# EAGLE design M420X (EAGLE 6.6.0)
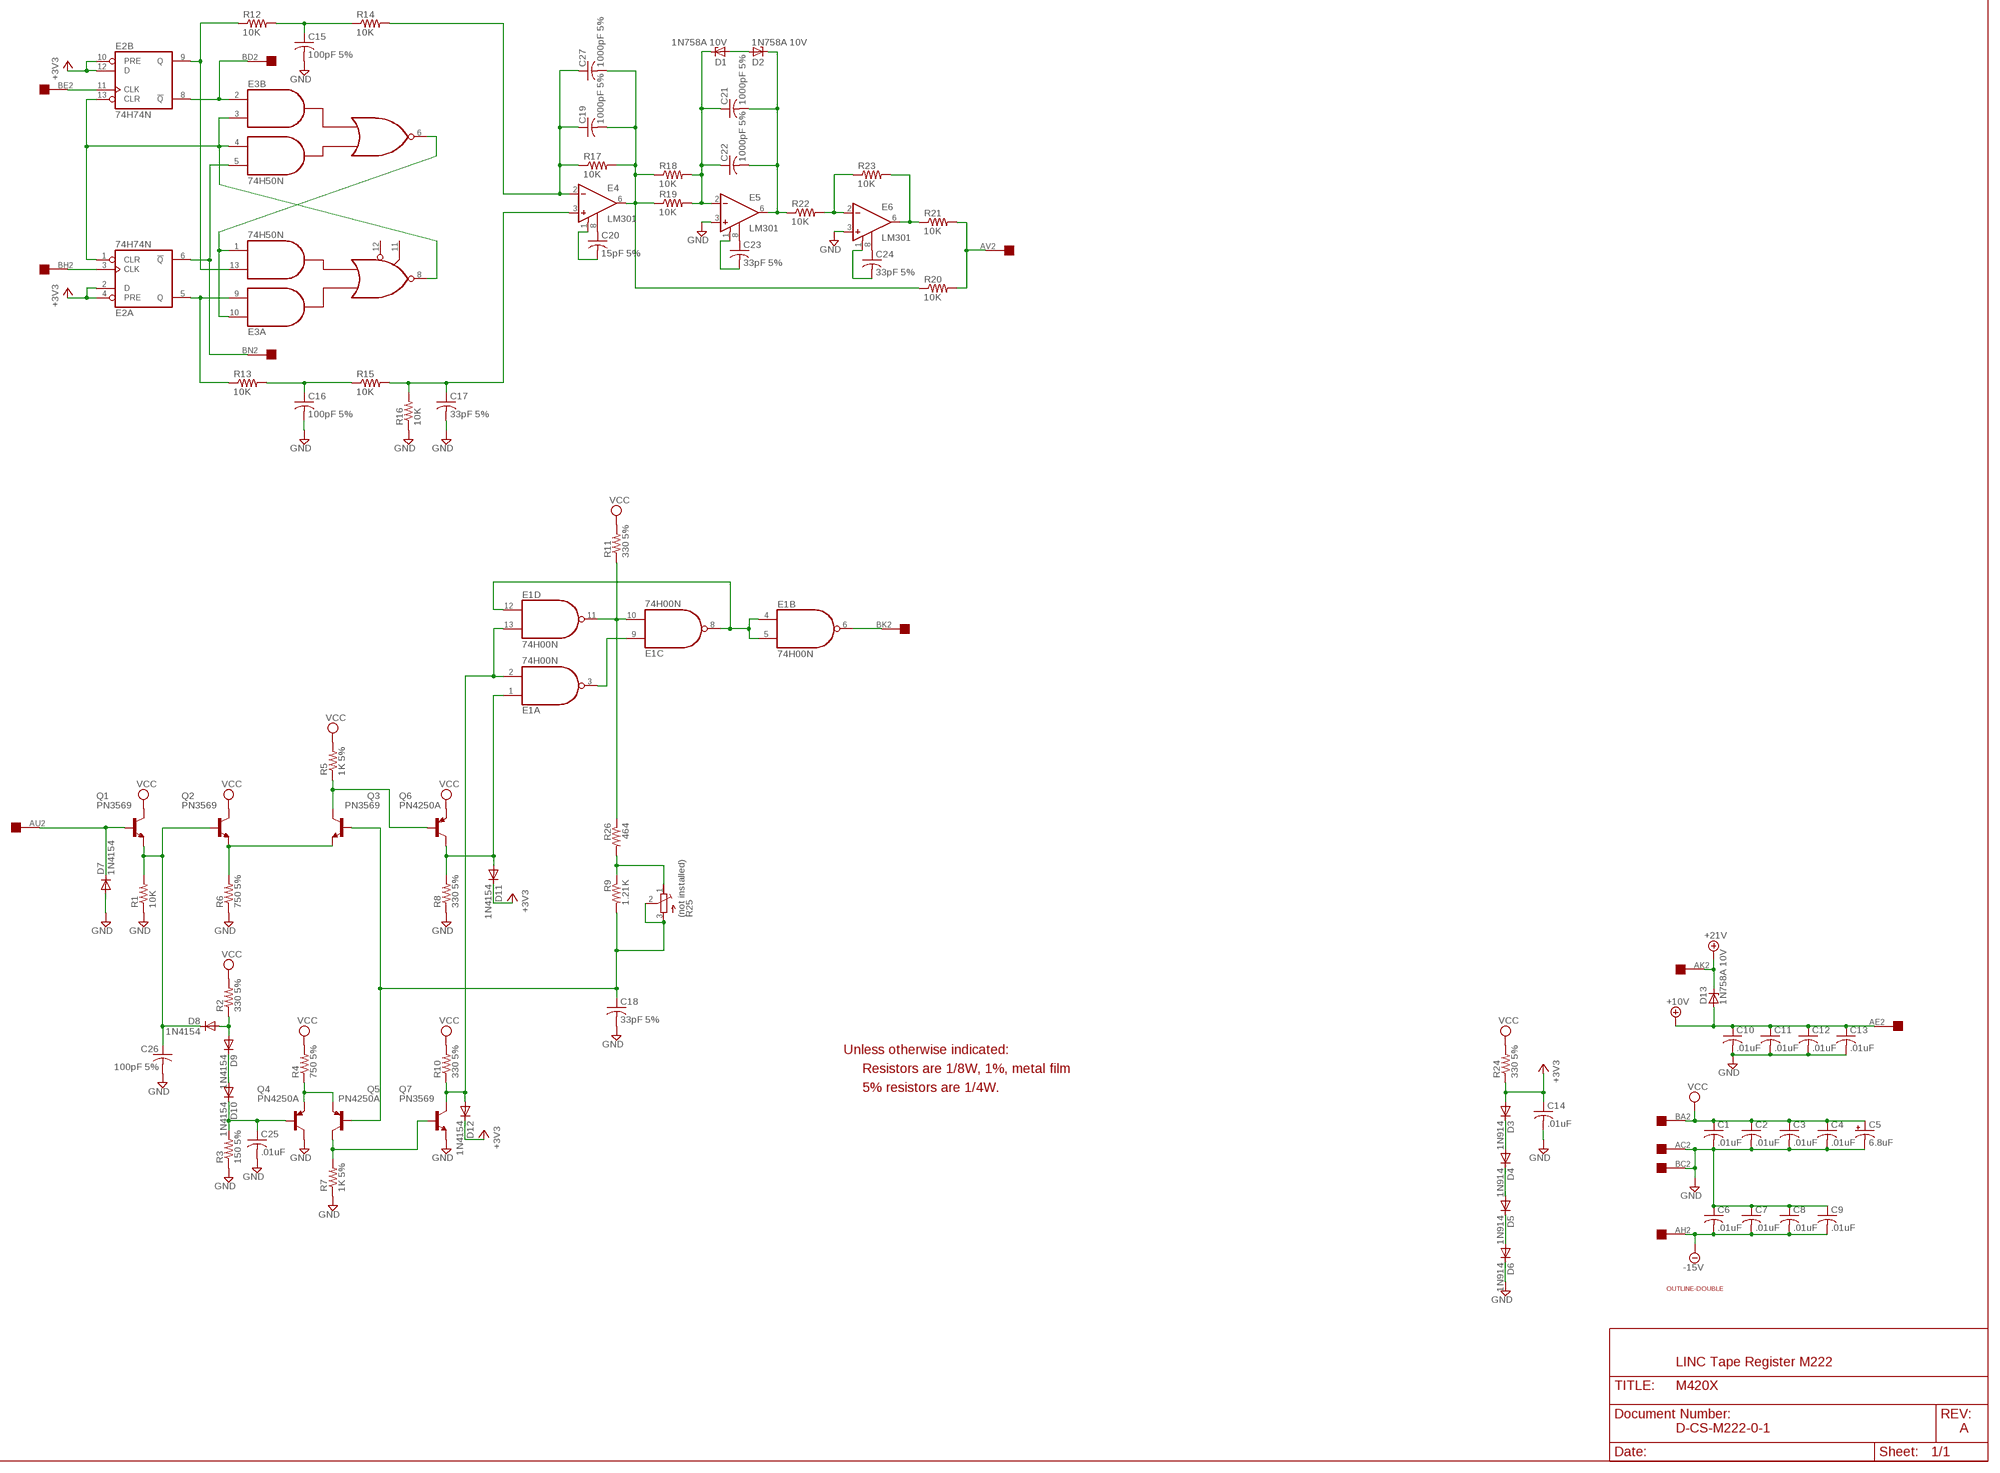
[diagram p0: schematic, sheet 1]

## Parts
C1  .01uF  C-US050-025X075  [C050-025X075]
C2  .01uF  C-US050-025X075  [C050-025X075]
C3  .01uF  C-US050-025X075  [C050-025X075]
C4  .01uF  C-US050-025X075  [C050-025X075]
C5  6.8uF  CPOL-USE20-8AXIAL  [E12-8]
C6  .01uF  C-US050-025X075  [C050-025X075]
C7  .01uF  C-US050-025X075  [C050-025X075]
C8  .01uF  C-US050-025X075  [C050-025X075]
C9  .01uF  C-US050-025X075  [C050-025X075]
C10  .01uF  C-US050-025X075  [C050-025X075]
C11  .01uF  C-US050-025X075  [C050-025X075]
C12  .01uF  C-US050-025X075  [C050-025X075]
C13  .01uF  C-US050-025X075  [C050-025X075]
C14  .01uF  C-US050-025X075  [C050-025X075]
C15  100pF 5%  C-US050-025X075  [C050-025X075]
C16  100pF 5%  C-US050-025X075  [C050-025X075]
C17  33pF 5%  C-US050-025X075  [C050-025X075]
C18  33pF 5%  C-US050-025X075  [C050-025X075]
C19  1000pF 5%  C-US050-025X075  [C050-025X075]
C20  15pF 5%  C-US050-025X075  [C050-025X075]
C21  1000pF 5%  C-US050-025X075  [C050-025X075]
C22  1000pF 5%  C-US050-025X075  [C050-025X075]
C23  33pF 5%  C-US050-025X075  [C050-025X075]
C24  33pF 5%  C-US050-025X075  [C050-025X075]
C25  .01uF  C-US050-025X075  [C050-025X075]
C26  100pF 5%  C-US050-025X075  [C050-025X075]
C27  1000pF 5%  C-US050-025X075  [C050-025X075]
D1  1N758A 10V  ZENER-DIODEDO35Z10  [DO35Z10]
D2  1N758A 10V  ZENER-DIODEDO35Z10  [DO35Z10]
D3  1N914  1N4148DO35-10  [DO35-10]
D4  1N914  1N4148DO35-10  [DO35-10]
D5  1N914  1N4148DO35-10  [DO35-10]
D6  1N914  1N4148DO35-10  [DO35-10]
D7  1N4154  1N4148DO35-10  [DO35-10]
D8  1N4154  1N4148DO35-10  [DO35-10]
D9  1N4154  1N4148DO35-10  [DO35-10]
D10  1N4154  1N4148DO35-10  [DO35-10]
D11  1N4154  1N4148DO35-10  [DO35-10]
D12  1N4154  1N4148DO35-10  [DO35-10]
D13  1N758A 10V  ZENER-DIODEDO35Z10  [DO35Z10]
E1  74H00N  7400N  [DIL14]
E2  74H74N  74S74N  [DIL14]
E3  74H50N  7450N  [DIL14]
E4  LM301  [TO99]
E5  LM301  [TO99]
E6  LM301  [TO99]
Q1  PN3569  2N3439  [TO5]
Q2  PN3569  2N3439  [TO5]
Q3  PN3569  2N3439  [TO5]
Q4  PN4250A  2N3635  [TO39]
Q5  PN4250A  2N3635  [TO39]
Q6  PN4250A  2N3635  [TO39]
Q7  PN3569  2N3439  [TO5]
R1  10K  R-US_0207/15  [0207/15]
R2  330 5%  R-US_0207/10  [0207/10]
R3  150 5%  R-US_0207/10  [0207/10]
R4  750 5%  R-US_0207/10  [0207/10]
R5  1K 5%  R-US_0207/10  [0207/10]
R6  750 5%  R-US_0207/10  [0207/10]
R7  1K 5%  R-US_0207/10  [0207/10]
R8  330 5%  R-US_0207/10  [0207/10]
R9  1.21K  R-US_0207/15  [0207/15]
R10  330 5%  R-US_0207/10  [0207/10]
R11  330 5%  R-US_0207/10  [0207/10]
R12  10K  R-US_0207/15  [0207/15]
R13  10K  R-US_0207/15  [0207/15]
R14  10K  R-US_0207/15  [0207/15]
R15  10K  R-US_0207/15  [0207/15]
R16  10K  R-US_0207/15  [0207/15]
R17  10K  R-US_0207/15  [0207/15]
R18  10K  R-US_0207/15  [0207/15]
R19  10K  R-US_0207/15  [0207/15]
R20  10K  R-US_0207/15  [0207/15]
R21  10K  R-US_0207/15  [0207/15]
R22  10K  R-US_0207/15  [0207/15]
R23  10K  R-US_0207/15  [0207/15]
R24  330 5%  R-US_0207/10  [0207/10]
R25  (not installed)  275P  [3006Y]
R26  464  R-US_0207/15  [0207/15]
U$1  DOUBLE  [EDGE-CON4]
U$2  OUTLINE-DOUBLE  [DOUBLE]

## Nets
+3V3 [Supply]: C14.1 D3.A D11.C D12.C E2.2(A:D) E2.4(A:PRE) E2.10(B:PRE) E2.12(B:D) R24.1
+10V [Supply]: C10.1 C11.1 C12.1 C13.1 D13.A U$1.AE2
+21V [Supply]: D13.C U$1.AK2
-15V [Supply]: C6.2 C7.2 C8.2 C9.2 U$1.AH2
GND [Supply]: C1.2 C2.2 C3.2 C4.2 C5.- C6.1 C7.1 C8.1 C9.1 C10.2 C11.2 C12.2 C13.2 C14.2 C15.2 C16.2 C17.2 C18.2 C25.2 C26.2 D6.C D7.A E5.3(+IN) E6.3(+IN) Q4.3(C) Q7.1(E) R1.1 R3.1 R6.1 R7.1 R8.1 R16.1 U$1.AC2 U$1.BC2
N$1: E2.1(A:CLR) E2.13(B:CLR) E3.3(B:I2) E3.4(B:I3) E3.8(A:O)
N$2: E3.1(A:I4) E3.6(B:O) E3.10(A:I1)
N$3: E2.8(B:!Q) E3.2(B:I1) U$1.BD2
N$4: E2.6(A:!Q) E3.5(B:I4) U$1.BN2
N$5: E2.3(A:CLK) U$1.BH2
N$6: C17.1 E4.3(+IN) R15.2 R16.2
N$7: C15.1 R12.2 R14.1
N$8: E2.9(B:Q) E3.13(A:I3) R12.1
N$9: E2.5(A:Q) E3.9(A:I2) R13.1
N$10: E2.11(B:CLK) U$1.BE2
N$11: D3.C D4.A
N$12: C16.1 R13.2 R15.1
N$13: C20.1 E4.8(CMP)
N$14: D5.C D6.A
N$15: C19.1 C27.1 E4.2(-IN) R14.2 R17.1
N$16: C20.2 E4.1(ON/CMP)
N$17: C19.2 C27.2 E4.6(OUT) R17.2 R18.1 R19.1 R20.1
N$18: C21.1 C22.1 D1.C E5.2(-IN) R18.2 R19.2
N$19: D4.C D5.A
N$20: C21.2 C22.2 D2.C E5.6(OUT) R22.1
N$21: D1.A D2.A
N$22: C23.1 E5.8(CMP)
N$23: C23.2 E5.1(ON/CMP)
N$24: E6.2(-IN) R22.2 R23.1
N$25: C24.1 E6.8(CMP)
N$26: C24.2 E6.1(ON/CMP)
N$27: E6.6(OUT) R21.1 R23.2
N$28: R20.2 R21.2 U$1.AV2
N$29: E1.6(B:O) U$1.BK2
N$30: E1.4(B:I0) E1.5(B:I1) E1.8(C:O) E1.12(D:I0)
N$31: E1.10(C:I1) E1.11(D:O) R11.1 R26.1
N$32: D12.A E1.2(A:I1) E1.13(D:I1) Q7.3(C) R10.1
N$33: D11.A E1.1(A:I0) Q6.3(C) R8.2
N$34: E1.3(A:O) E1.9(C:I0)
N$35: D7.C Q1.2(B) U$1.AU2
N$36: C26.1 D8.C Q1.1(E) Q2.2(B) R1.2
N$37: Q2.1(E) Q3.1(E) R6.2
N$38: Q3.3(C) Q6.2(B) R5.1
N$39: C18.1 Q3.2(B) Q5.2(B) R9.2 R25.2(S) R25.3(E)
N$40: Q4.1(E) Q5.1(E) R4.1
N$41: Q5.3(C) Q7.2(B) R7.2
N$42: R9.1 R25.1(A) R26.2
N$44: D8.A D9.A R2.1
N$45: D9.C D10.A
N$46: C25.1 D10.C Q4.2(B) R3.2
VCC [Supply]: C1.1 C2.1 C3.1 C4.1 C5.+ Q1.3(C) Q2.3(C) Q6.1(E) R2.2 R4.2 R5.2 R10.2 R11.2 R24.2 U$1.BA2
Unconnected: E3.11(A:I6) E3.12(A:I5) U$1.AA1 U$1.AA2 U$1.AB1 U$1.AB2 U$1.AC1 U$1.AD1 U$1.AD2 U$1.AE1 U$1.AF1 U$1.AF2 U$1.AH1 U$1.AJ1 U$1.AJ2 U$1.AK1 U$1.AL1 U$1.AL2 U$1.AM1 U$1.AM2 U$1.AN1 U$1.AN2 U$1.AP1 U$1.AP2 U$1.AR1 U$1.AR2 U$1.AS1 U$1.AS2 U$1.AT1 U$1.AT2 U$1.AU1 U$1.AV1 U$1.BA1 U$1.BB1 U$1.BB2 U$1.BC1 U$1.BD1 U$1.BE1 U$1.BF1 U$1.BF2 U$1.BH1 U$1.BJ1 U$1.BJ2 U$1.BK1 U$1.BL1 U$1.BL2 U$1.BM1 U$1.BM2 U$1.BN1 U$1.BP1 U$1.BP2 U$1.BR1 U$1.BR2 U$1.BS1 U$1.BS2 U$1.BT1 U$1.BT2 U$1.BU1 U$1.BU2 U$1.BV1 U$1.BV2

## Notes on the sheet
- Unless otherwise indicated:
- Resistors are 1/8W, 1%, metal film
- 5% resistors are 1/4W.
- LINC Tape Register M222
- D-CS-M222-0-1 | A

## Power pins joined to a net without a drawn wire
+10V: E4.7(+10V) E5.7(+10V) E6.7(+10V)
-15V: E4.4(-15V) E5.4(-15V) E6.4(-15V)
GND: E1.7(P:GND) E2.7(P:GND) E3.7(P:GND)
VCC: E1.14(P:VCC) E2.14(P:VCC) E3.14(P:VCC)

## Library data of the parts
C1-C4 C6-C27 = rcl:C-US: CAPACITOR, American symbol
C5 = dec-con:CPOL-USE20-8AXIAL: A 0.8 inch electrolytic.
D1 D2 D13 = diode:ZENER-DIODE: Z-Diode
D3-D12 = diode:1N4148: DIODE high speed (Philips)
E1 = 74xx-us:74*00: Quad 2-input NAND gate
E2 = 74xx-us:74*74: Dual D type positive edge triggered FLIP FLOP, preset and clear
E3 = dec-con:74*50: 4-2-3-2 input AND OR INVERTER gates
E4-E6 = dec-con:LM301: LM301 Operational Amplifier
Q1-Q3 Q7 = transistor-npn:2N3439: NPN Transistor
Q4-Q6 = transistor-pnp:2N3635*: PNP Transistror
R1-R24 R26 = rcl:R-US_: RESISTOR, American symbol
R25 = dec-con:275P: Trimpot with 275P (3006Y) footprint.
U$1 = dec-con:DOUBLE: Double-Height DEC board
U$2 = dec-con:OUTLINE-*: Board outlines for DEC boards.

## Net classes
1 Supply: width 0.813 mm

## Board
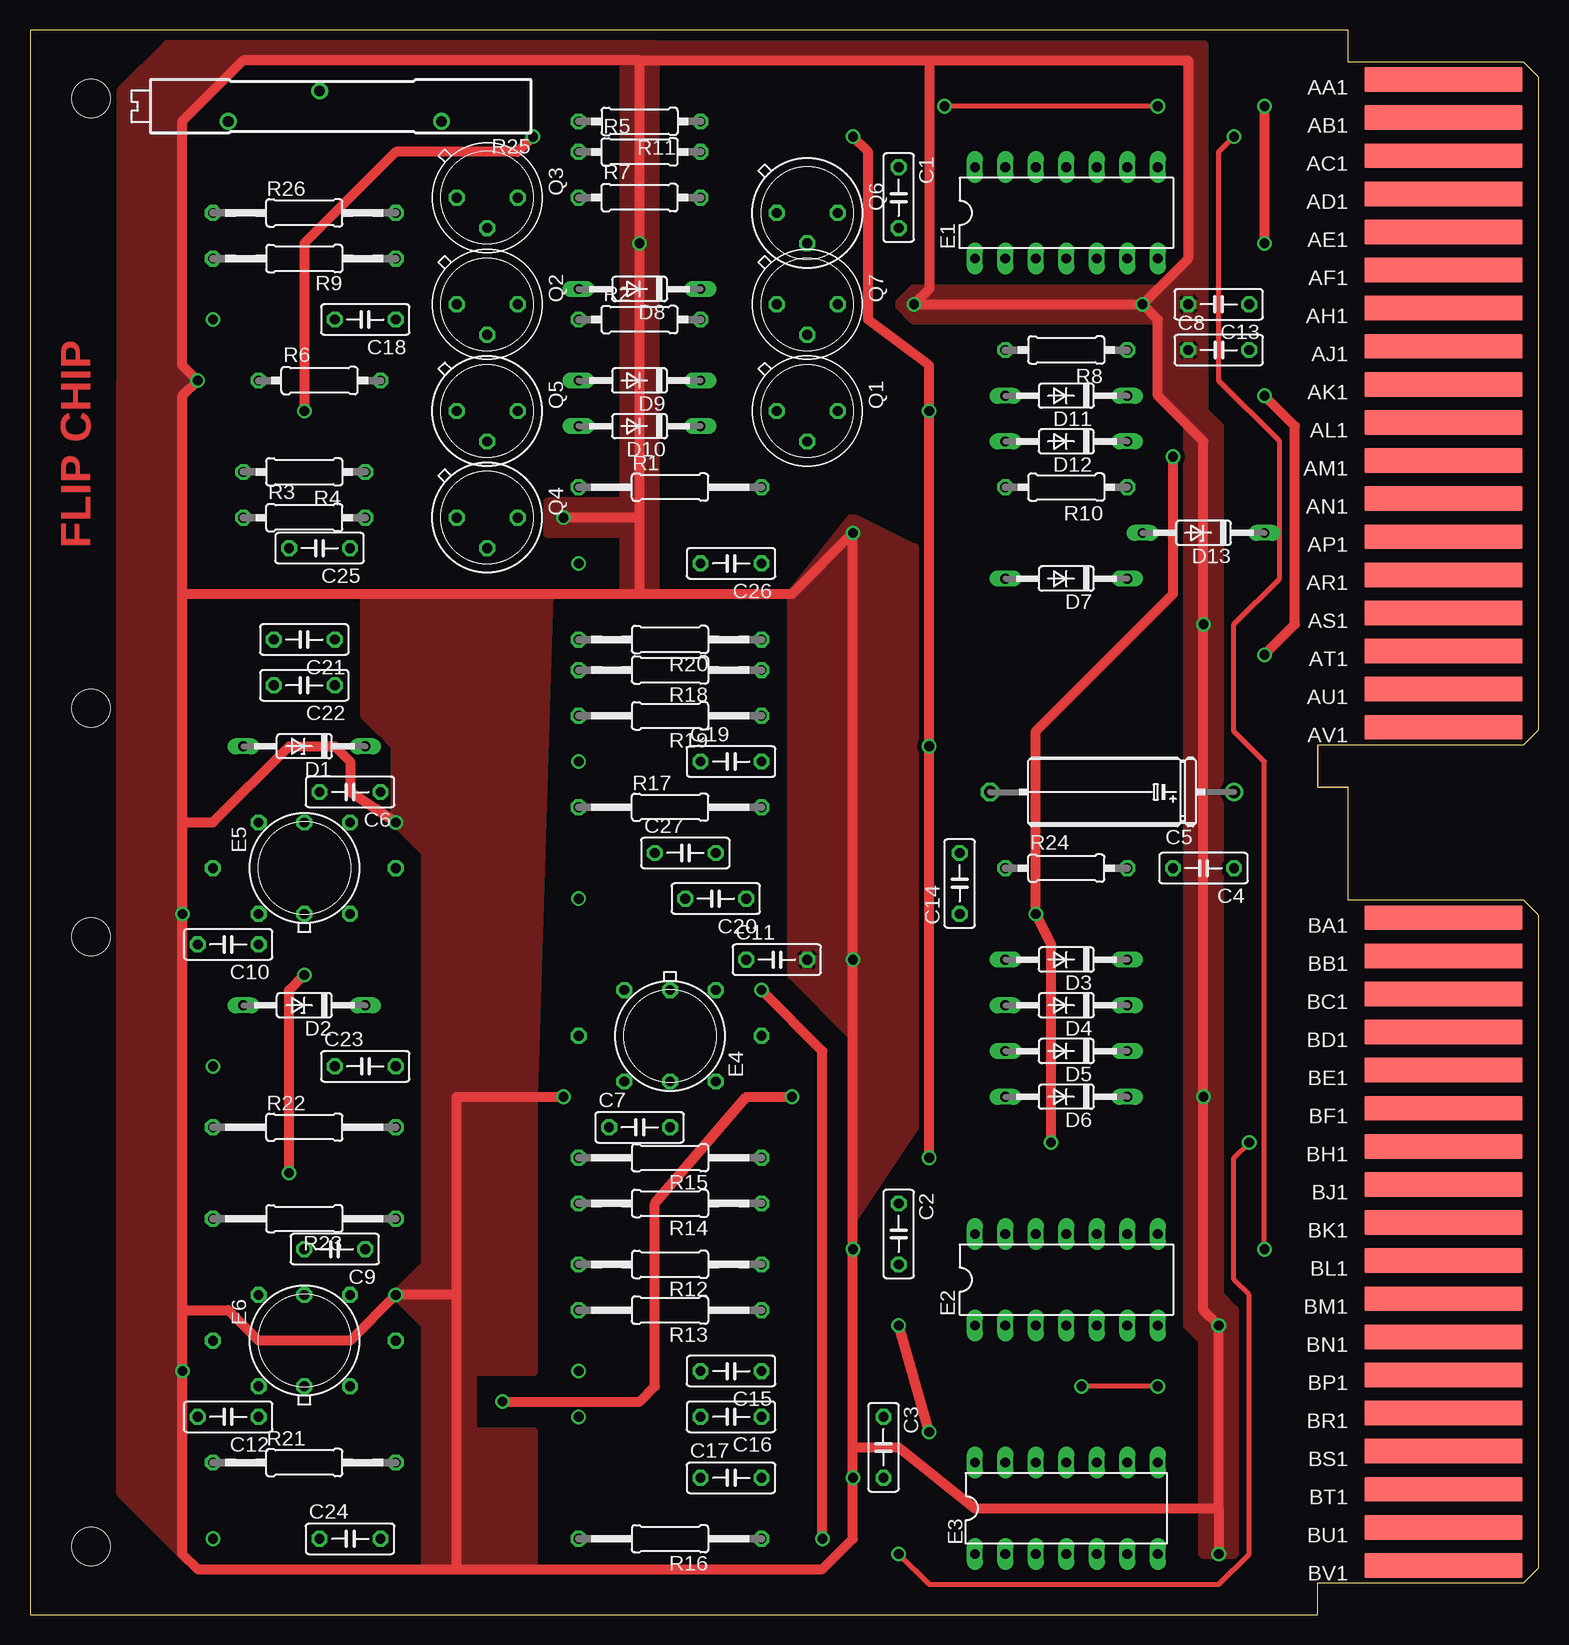
[diagram p1: board, top side]
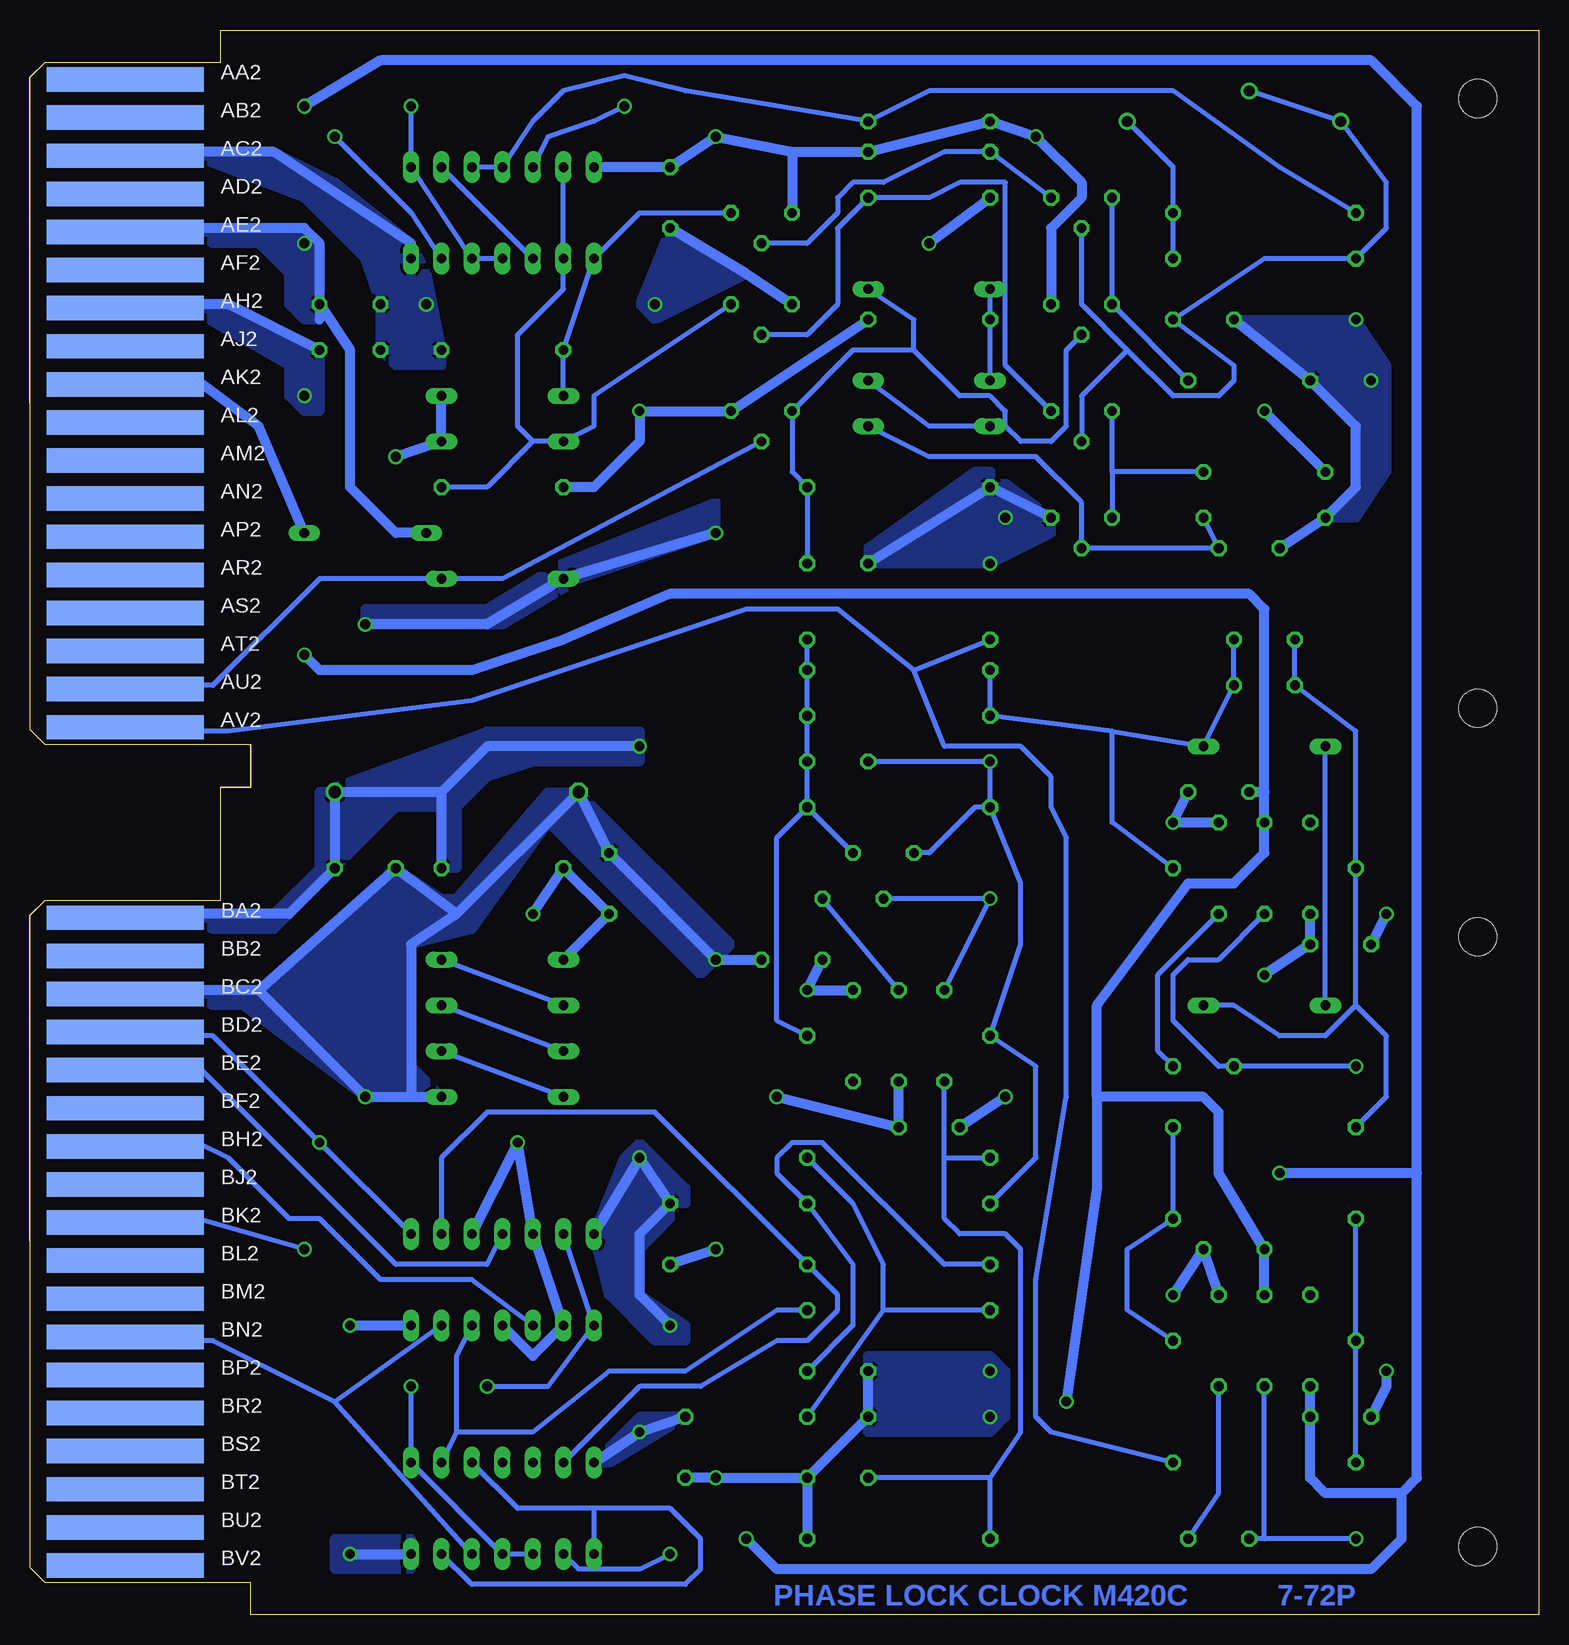
[diagram p2: board, bottom side, seen from below]

Size 125.73 x 132.08 mm. Coordinates in mm from the lower left corner, seen from the top.
Copper layers (1+16): Top 0.035mm / dielectric 1.5mm / Bottom 0.035mm
Design rules "16mils": minimum track width 16mil, minimum drill 32mil, track to track 15mil, track to pad 10mil, pad to pad 10mil, via to via 10mil, smd to smd 10mil, copper to edge 13mil, drill to drill 10mil, minimum pad ring 10mil, minimum via ring 8mil, stop-mask expansion 0mil, vias tented up to drill 0mil, thermal gap 10mil

### Footprints (pad centres in the part's own frame; a part is rotated, then mirrored left to right if it is on the bottom)
C050-025X075 = drill 0.813 octagon: 1 -2.54,0; 2 2.54,0
E12-8 = drill 1.016: + -10.16,0 | drill 1.016 octagon: - 10.16,0
DO35Z10 = drill 0.813 long: A 5.08,0; C -5.08,0
DO35-10 = drill 0.813 long: A 5.08,0; C -5.08,0
DIL14 = drill 0.813 long: 1 -7.62,-3.81; 2 -5.08,-3.81; 3 -2.54,-3.81; 4 0,-3.81; 5 2.54,-3.81; 6 5.08,-3.81; 7 7.62,-3.81; 8 7.62,3.81; 9 5.08,3.81; 10 2.54,3.81; 11 0,3.81; 12 -2.54,3.81; 13 -5.08,3.81; 14 -7.62,3.81
TO99 = drill 0.813 octagon: 1 -3.81,-3.81; 2 0,-7.62; 3 3.81,-3.81; 4 3.81,0; 5 3.81,3.81; 6 0,7.62; 7 -3.81,3.81; 8 -3.81,0
TO5 = drill 0.813 octagon: 1 0,-2.54; 2 2.54,0; 3 0,2.54
TO39 = drill 0.813 octagon: 1 0,-2.54; 2 2.54,0; 3 0,2.54
0207/15 = drill 0.813 octagon: 1 -7.62,0; 2 7.62,0
0207/10 = drill 0.813 octagon: 1 -5.08,0; 2 5.08,0
3006Y = drill 0.9: 1 -8.89,1.27; 2 1.27,-1.27; 3 8.89,1.27
EDGE-CON4 = smd 13.106 x 2.032: AA1 7.938,4.128; AB1 7.938,7.303; AC1 7.938,10.477; AD1 7.938,13.652; AE1 7.938,16.828; AF1 7.938,20.003; AH1 7.938,23.177; AJ1 7.938,26.352; AK1 7.938,29.527; AL1 7.938,32.703; AM1 7.938,35.877; AN1 7.938,39.053; AP1 7.938,42.227; AR1 7.938,45.403; AS1 7.938,48.578; AT1 7.938,51.752; AU1 7.938,54.928; AV1 7.938,58.102; BA1 7.938,73.978; BB1 7.938,77.153; BC1 7.938,80.328; BD1 7.938,83.502; BE1 7.938,86.677; BF1 7.938,89.853; BH1 7.938,93.028; BJ1 7.938,96.203; BK1 7.938,99.377; BL1 7.938,102.552; BM1 7.938,105.728; BN1 7.938,108.903; BP1 7.938,112.078; BR1 7.938,115.252; BS1 7.938,118.427; BT1 7.938,121.603; BU1 7.938,124.778; BV1 7.938,127.953 | smd 13.106 x 2.032 bottom: AA2 7.938,4.128; AB2 7.938,7.303; AC2 7.938,10.477; AD2 7.938,13.652; AE2 7.938,16.828; AF2 7.938,20.003; AH2 7.938,23.177; AJ2 7.938,26.352; AK2 7.938,29.527; AL2 7.938,32.703; AM2 7.938,35.877; AN2 7.938,39.053; AP2 7.938,42.227; AR2 7.938,45.403; AS2 7.938,48.578; AT2 7.938,51.752; AU2 7.938,54.928; AV2 7.938,58.102; BA2 7.938,73.978; BB2 7.938,77.153; BC2 7.938,80.328; BD2 7.938,83.502; BE2 7.938,86.677; BF2 7.938,89.853; BH2 7.938,93.028; BJ2 7.938,96.203; BK2 7.938,99.377; BL2 7.938,102.552; BM2 7.938,105.728; BN2 7.938,108.903; BP2 7.938,112.078; BR2 7.938,115.252; BS2 7.938,118.427; BT2 7.938,121.603; BU2 7.938,124.778; BV2 7.938,127.953
DOUBLE = hole 3.175: 120.65,56.515; 120.65,5.715; 120.65,75.565; 120.65,126.365

### Placement (x,y rotation side)
C1  72.39,118.11 270 top
C2  72.39,31.75 270 top
C3  71.12,13.97 270 top
C4  97.79,62.23 180 top
C5  90.17,68.58 180 top
C6  26.67,68.58 180 top
C7  50.8,40.64 0 top
C8  99.06,105.41 0 top
C9  25.4,30.48 180 top
C10  16.51,55.88 180 top
C11  62.23,54.61 0 top
C12  16.51,16.51 180 top
C13  99.06,109.22 180 top
C14  77.47,60.96 90 top
C15  58.42,20.32 180 top
C16  58.42,16.51 180 top
C17  58.42,11.43 0 top
C18  27.94,107.95 180 top
C19  58.42,71.12 0 top
C20  57.15,59.69 180 top
C21  22.86,81.28 180 top
C22  22.86,77.47 180 top
C23  27.94,45.72 0 top
C24  26.67,6.35 0 top
C25  24.13,88.9 180 top
C26  58.42,87.63 180 top
C27  54.61,63.5 0 top
D1  22.86,72.39 180 top
D2  22.86,50.8 180 top
D3  86.36,54.61 180 top
D4  86.36,50.8 180 top
D5  86.36,46.99 180 top
D6  86.36,43.18 180 top
D7  86.36,86.36 180 top
D8  50.8,110.49 180 top
D9  50.8,102.87 180 top
D10  50.8,99.06 180 top
D11  86.36,101.6 180 top
D12  86.36,97.79 180 top
D13  97.79,90.17 180 top
E1  86.36,116.84 0 top
E2  86.36,27.94 0 top
E3  86.36,8.89 0 top
E4  53.34,48.26 270 top
E5  22.86,62.23 90 top
E6  22.86,22.86 90 top
Q1  64.77,100.33 270 top
Q2  38.1,109.22 270 top
Q3  38.1,118.11 270 top
Q4  38.1,91.44 270 top
Q5  38.1,100.33 270 top
Q6  64.77,116.84 270 top
Q7  64.77,109.22 270 top
R1  53.34,93.98 0 top
R2  50.8,107.95 0 top
R3  22.86,91.44 0 top
R4  22.86,95.25 180 top
R5  50.8,121.92 0 top
R6  24.13,102.87 0 top
R7  50.8,118.11 0 top
R8  86.36,105.41 180 top
R9  22.86,113.03 180 top
R10  86.36,93.98 180 top
R11  50.8,124.46 180 top
R12  53.34,29.21 180 top
R13  53.34,25.4 180 top
R14  53.34,34.29 180 top
R15  53.34,38.1 180 top
R16  53.34,6.35 180 top
R17  53.34,67.31 0 top
R18  53.34,78.74 180 top
R19  53.34,74.93 180 top
R20  53.34,81.28 180 top
R21  22.86,12.7 0 top
R22  22.86,40.64 0 top
R23  22.86,33.02 180 top
R24  86.36,62.23 0 top
R25  25.4,125.73 180 top
R26  22.86,116.84 0 top
U$1  125.73,132.08 180 top
U$2  125.73,132.08 180 top
U$4  [FLIPCHIP]  0,69.85 0 top

### Tracks (layer width: path | path; a pad name or v marks a point on that pad's centre or on a via)
+3V3  (via drill 0.81)
  Top 0.813: v85.09,39.37 85.09,55.88 v83.82,58.42 83.82,73.66 95.25,85.09 v95.25,96.52
  Bottom 0.813: D11.C D12.C v95.25,96.52 | D3.A C14.1 R24.1 v83.82,58.42 | E2.4 83.82,21.59 E2.2 E2.12 v85.09,39.37 E2.10
+10V  (via drill 0.81)
  Top 0.813: v102.87,125.73 v102.87,114.3 | v60.96,52.07 66.04,46.99 v66.04,6.35 | v21.59,36.83 21.59,52.07 v22.86,53.34
  Bottom 0.813: U$1.AE2 116.84,115.57 102.87,115.57 101.6,114.3 C13.1 | C13.1 101.6,107.95 | C13.1 99.06,105.41 99.06,93.98 95.25,90.17 D13.A | v102.87,125.73 96.52,129.54 13.97,129.54 10.16,125.73 10.16,36.83 | 10.16,36.83 10.16,11.43 11.43,10.16 | 11.43,10.16 17.78,10.16 19.05,11.43 C12.1 E6.7 | 11.43,10.16 11.43,6.35 13.97,3.81 63.5,3.81 v66.04,6.35 | 10.16,36.83 v21.59,36.83 | E4.7 v60.96,52.07 C11.1 | v22.86,53.34 C10.1 E5.7
  pour Bottom: 113.03,115.57 102.87,115.57 101.6,114.3 101.6,107.95 102.87,107.95 104.14,109.22 104.14,111.76 106.68,114.3 110.49,114.3
+21V
  Bottom 0.813: U$1.AK2 116.84,102.87 111.76,102.87 106.68,99.06 D13.C
-15V  (via drill 0.81)
  Top 0.813: v39.37,17.78 50.8,17.78 52.07,19.05 52.07,34.29 59.69,43.18 v63.5,43.18 | v102.87,101.6 105.41,99.06 105.41,82.55 v102.87,80.01
  Bottom 0.813: U$1.AH2 116.84,109.22 109.22,109.22 C8.2 | E6.4 C9.2 26.67,36.83 26.67,41.91 27.94,43.18 36.83,43.18 | 36.83,43.18 36.83,35.56 v39.37,17.78 | 22.86,68.58 E5.4 22.86,63.5 25.4,60.96 29.21,60.96 36.83,50.8 36.83,43.18 | 22.86,68.58 C6.2 | 22.86,68.58 22.86,83.82 24.13,85.09 72.39,85.09 81.28,81.28 88.9,78.74 101.6,78.74 v102.87,80.01 | E4.4 C7.2 v63.5,43.18
  pour Bottom: 113.03,109.22 109.22,109.22 101.6,105.41 101.6,100.33 102.87,100.33 104.14,101.6 104.14,104.14
GND  (via drill 0.81)
  Top 0.813: 12.7,25.4 v12.7,20.32 12.7,5.08 13.97,3.81 35.56,3.81 | 12.7,25.4 16.51,25.4 19.05,22.86 26.67,22.86 v30.48,26.67 35.56,26.67 | v92.71,109.22 v73.66,109.22 74.93,110.49 74.93,129.54 | v30.48,66.04 26.67,68.58 26.67,71.12 25.4,72.39 21.59,72.39 15.24,66.04 12.7,66.04 | 12.7,66.04 12.7,85.09 | 12.7,85.09 12.7,101.6 v13.97,102.87 12.7,104.14 12.7,124.46 17.78,129.54 50.8,129.54 | 12.7,66.04 v12.7,58.42 12.7,25.4 | 99.06,8.89 v99.06,24.13 97.79,25.4 v97.79,43.18 v97.79,82.55 97.79,97.79 93.98,101.6 93.98,107.95 v92.71,109.22 | 50.8,85.09 63.5,85.09 v68.58,90.17 v68.58,54.61 v68.58,30.48 68.58,13.97 | 50.8,85.09 50.8,91.44 | 50.8,91.44 v44.45,91.44 | 12.7,85.09 50.8,85.09 | 50.8,91.44 v50.8,114.3 50.8,129.54 | 35.56,3.81 35.56,26.67 | 35.56,3.81 66.04,3.81 68.58,6.35 v68.58,11.43 68.58,13.97 | v44.45,43.18 35.56,43.18 35.56,26.67 | 50.8,129.54 74.93,129.54 | 74.93,129.54 96.52,129.54 96.52,113.03 v92.71,109.22 | 68.58,13.97 72.39,13.97 78.74,8.89 99.06,8.89 | 99.06,8.89 v99.06,5.08
  Bottom 0.813: U$1.AC2 116.84,121.92 105.41,121.92 93.98,114.3 E1.7 | Q7.1 66.04,111.76 C1.2 | C17.2 R16.1 | C17.2 C16.2 C15.2 | C17.2 v68.58,11.43 C3.2 | E6.3 C9.1 v30.48,26.67 | C12.2 12.7,19.05 v12.7,20.32 | v12.7,58.42 C10.2 | E5.3 v30.48,66.04 C6.1 | C25.2 R3.1 15.24,93.98 15.24,99.06 R6.1 C18.2 | Q4.3 R1.1 C26.2 | v50.8,114.3 R7.1 | v68.58,90.17 D7.A 87.63,82.55 v97.79,82.55 | C11.2 v68.58,54.61 C14.2 C5.- 90.17,58.42 | 90.17,58.42 C4.2 106.68,52.07 | U$1.BC2 116.84,52.07 106.68,52.07 | 93.98,43.18 v97.79,43.18 106.68,52.07 | 93.98,43.18 D6.C | 90.17,58.42 93.98,55.88 93.98,43.18 | v44.45,43.18 C7.1 | v99.06,5.08 E3.7 | v99.06,24.13 E2.7 | v68.58,30.48 C2.2
  other vias: 15.24,107.95 45.72,20.32 45.72,16.51 45.72,87.63
  pour Bottom: 113.03,121.92 105.41,121.92 100.33,119.38 93.98,114.3 92.71,111.76 91.44,105.41 91.44,104.14 95.25,104.14 96.52,105.41 96.52,109.22 97.79,113.03 102.87,118.11
  pour Bottom: 72.39,115.57 74.93,109.22 73.66,107.95 66.04,111.76
  pour Bottom: 25.4,107.95 15.24,107.95 12.7,104.14 12.7,95.25 15.24,91.44 17.78,91.44 15.24,93.98 15.24,99.06 19.05,102.87
  pour Bottom: 40.64,91.44 45.72,95.25 46.99,95.25 55.88,88.9 55.88,87.63 45.72,87.63 40.64,90.17
  pour Bottom: 55.88,21.59 45.72,21.59 44.45,20.32 44.45,16.51 45.72,15.24 55.88,15.24
  pour Bottom: 93.98,5.08 93.98,3.81 100.33,3.81 100.33,6.35 93.98,6.35
  pour Bottom: 68.58,54.61 69.85,53.34 78.74,62.23 82.55,66.04 88.9,57.15 93.98,55.88 93.98,45.72 91.44,43.18 97.79,43.18 107.95,50.8 110.49,50.8 113.03,52.07 106.68,52.07 95.25,62.23 91.44,59.69 90.17,59.69 82.55,68.58 80.01,68.58 67.31,55.88
  pour Bottom: 68.58,90.17 68.58,92.71 81.28,87.63 87.63,83.82 97.79,83.82 97.79,82.55 86.36,82.55 80.01,86.36
  pour Top: 12.7,20.32 7.62,20.32 7.62,102.87 13.97,102.87 12.7,101.6
  pour Top: 12.7,5.08 7.62,10.16 7.62,20.32 12.7,20.32
  pour Top: 13.97,102.87 12.7,104.14 12.7,124.46 17.78,129.54 49.53,129.54 49.53,85.09 52.07,85.09 52.07,130.81 11.43,130.81 7.62,127 7.62,102.87
  pour Top: 33.02,3.81 33.02,24.13 30.48,26.67 33.02,29.21 33.02,63.5 30.48,66.04 30.48,72.39 27.94,74.93 27.94,85.09 43.18,85.09 41.91,43.18 41.91,20.32 36.83,20.32 36.83,15.24 41.91,15.24 41.91,3.81
  pour Top: 49.53,92.71 43.18,92.71 43.18,90.17 49.53,90.17
  pour Top: 63.5,85.09 68.58,91.44 73.66,88.9 73.66,40.64 68.58,33.02 68.58,48.26 63.5,53.34
  pour Top: 100.33,5.08 97.79,5.08 97.79,22.86 96.52,24.13 96.52,82.55 96.52,99.06 93.98,101.6 93.98,107.95 73.66,107.95 72.39,109.22 73.66,110.49 93.98,110.49 96.52,113.03 96.52,129.54 97.79,129.54 97.79,100.33 99.06,99.06 99.06,80.01 99.06,43.18 99.06,26.67 100.33,25.4
  pour Top: 52.07,130.81 97.79,130.81 97.79,129.54 52.07,129.54
N$1  (via drill 0.81)
  Top 0.406: v93.98,19.05 v87.63,19.05
  Bottom 0.406: E2.13 E2.1 82.55,19.05 v87.63,19.05 | v93.98,19.05 E3.8 E3.4 E3.3
N$2
  Bottom 0.406: E3.6 88.9,2.54 71.12,2.54 69.85,3.81 69.85,6.35 72.39,8.89 78.74,8.89 | 78.74,8.89 E3.1 | E3.10 85.09,8.89 78.74,8.89
N$3  (via drill 0.81)
  Top 0.406: v101.6,39.37 100.33,38.1 100.33,27.94 101.6,26.67 101.6,5.08 99.06,2.54 74.93,2.54 v72.39,5.08
  Bottom 0.406: U$1.BD2 116.84,48.26 110.49,48.26 v101.6,39.37 E2.8 | E3.2 80.01,3.81 74.93,3.81 v72.39,5.08
N$4
  Bottom 0.406: U$1.BN2 116.84,22.86 110.49,22.86 100.33,17.78 | 100.33,17.78 E2.6 | E3.5 100.33,17.78
N$5
  Bottom 0.406: U$1.BH2 116.84,39.37 111.76,39.37 109.22,38.1 104.14,33.02 101.6,33.02 96.52,27.94 88.9,27.94 E2.3
N$6
  Bottom 0.406: 45.72,11.43 C17.1 | R16.2 45.72,11.43 | 49.53,38.1 R15.2 | 49.53,38.1 E4.3 | 45.72,11.43 43.18,15.24 43.18,30.48 44.45,31.75 48.26,31.75 49.53,33.02 49.53,38.1
N$7
  Bottom 0.406: C15.1 57.15,24.13 57.15,29.21 R14.1 63.5,36.83 63.5,38.1 62.23,39.37 59.69,39.37 49.53,29.21 R12.2
N$8
  Bottom 0.406: E3.13 74.93,19.05 69.85,19.05 63.5,22.86 60.96,22.86 58.42,25.4 58.42,26.67 R12.1 73.66,41.91 87.63,41.91 91.44,38.1 E2.9
N$9
  Bottom 0.406: R13.1 63.5,25.4 71.12,20.32 77.47,20.32 83.82,15.24 90.17,15.24 | 90.17,15.24 90.17,21.59 E2.5 | 90.17,15.24 E3.9
N$10
  Bottom 0.406: U$1.BE2 116.84,45.72 111.76,45.72 95.25,29.21 87.63,29.21 E2.11
N$11
  Bottom 0.406: D4.A D3.C
N$12
  Bottom 0.406: R13.2 54.61,25.4 | 54.61,25.4 C16.1 | R15.1 57.15,34.29 54.61,29.21 54.61,25.4
N$13
  Bottom 0.406: E4.8 C20.1
N$14
  Bottom 0.406: D6.A D5.C
N$15  (via drill 0.81)
  Bottom 0.406: C19.1 v45.72,71.12 R17.1 | C27.1 50.8,63.5 46.99,67.31 R17.1 | R17.1 43.18,60.96 43.18,55.88 E4.2 41.91,45.72 41.91,38.1 R14.2
N$16  (via drill 0.81)
  Bottom 0.406: E4.1 v45.72,59.69 C20.2
N$17
  Bottom 0.406: R20.1 R18.1 R19.1 C19.2 R17.2 | R17.2 C27.2 | E4.6 63.5,49.53 63.5,64.77 R17.2
N$18
  Bottom 0.406: C21.1 C22.1 D1.C 35.56,73.66 | 35.56,73.66 R19.2 R18.2 | E5.2 35.56,66.04 35.56,73.66
N$19
  Bottom 0.406: D5.A D4.C
N$20
  Bottom 0.406: R22.1 12.7,43.18 12.7,48.26 15.24,50.8 | 15.24,50.8 E5.6 15.24,73.66 C22.2 C21.2 | D2.C 25.4,50.8 21.59,48.26 17.78,48.26 15.24,50.8
N$21
  Bottom 0.406: D2.A D1.A
N$22  (via drill 0.81)
  Bottom 0.406: v15.24,45.72 C23.1 26.67,45.72 30.48,49.53 30.48,53.34 29.21,54.61 26.67,54.61 E5.8
N$23
  Bottom 0.406: C23.2 31.75,46.99 31.75,53.34 E5.1
N$24
  Bottom 0.406: R22.2 R23.1 34.29,30.48 34.29,25.4 E6.2
N$25  (via drill 0.81)
  Bottom 0.406: 22.86,6.35 C24.1 | 22.86,6.35 E6.8 | v15.24,6.35 22.86,6.35
N$26
  Bottom 0.406: C24.2 26.67,10.16 E6.1
N$27
  Bottom 0.406: R21.1 E6.6 R23.2
N$28
  Bottom 0.406: U$1.AV2 116.84,73.66 109.22,73.66 88.9,76.2 66.04,83.82 58.42,83.82 52.07,78.74 | 52.07,78.74 R20.2 | R21.2 40.64,15.24 41.91,16.51 41.91,27.94 39.37,43.18 39.37,64.77 40.64,67.31 40.64,69.85 43.18,72.39 49.53,72.39 52.07,78.74
N$29  (via drill 0.81)
  Top 0.406: v100.33,123.19 99.06,121.92 99.06,102.87 104.14,97.79 104.14,86.36 100.33,82.55 100.33,73.66 102.87,71.12 v102.87,30.48
  Bottom 0.406: E1.6 93.98,116.84 v100.33,123.19 | U$1.BK2 116.84,33.02 111.76,33.02 v102.87,30.48
N$30  (via drill 0.81)
  Top 0.406: v93.98,125.73 v76.2,125.73
  Bottom 0.406: E1.4 E1.5 E1.8 v93.98,125.73 | E1.12 82.55,123.19 78.74,124.46 v76.2,125.73
N$31
  Bottom 0.406: E1.10 E1.11 83.82,124.46 81.28,127 76.2,128.27 71.12,127 R11.1 50.8,127 30.48,127 21.59,120.65 R26.1
N$32
  Bottom 0.406: E1.13 E1.2 81.28,110.49 85.09,106.68 85.09,99.06 83.82,97.79 | 83.82,97.79 D12.A 78.74,99.06 78.74,101.6 Q7.3 | R10.1 87.63,93.98 83.82,97.79
N$33
  Bottom 0.406: D11.A R8.2 E1.1 74.93,116.84 Q6.3
N$34
  Bottom 0.406: E1.3 E1.9
N$35
  Bottom 0.406: U$1.AU2 116.84,77.47 110.49,77.47 101.6,86.36 D7.C 86.36,86.36 Q1.2
N$36
  Bottom 0.406: Q2.2 39.37,105.41 39.37,99.06 40.64,97.79 43.18,97.79 44.45,99.06 44.45,100.33 45.72,101.6 48.26,101.6 52.07,105.41 | D8.C 52.07,107.95 52.07,105.41 | 52.07,105.41 57.15,105.41 Q1.1 62.23,95.25 R1.2 C26.1
N$37
  Bottom 0.406: R6.2 Q2.1 Q3.1
N$38
  Bottom 0.406: Q6.2 60.96,114.3 58.42,116.84 58.42,118.11 57.15,119.38 54.61,119.38 49.53,121.92 R5.1 Q3.3
N$39
  Bottom 0.406: R25.2 R25.3 12.7,119.38 12.7,115.57 R9.2 22.86,113.03 C18.1 25.4,104.14 25.4,102.87 26.67,101.6 30.48,101.6 34.29,105.41 | Q3.2 38.1,109.22 34.29,105.41 | Q5.2 38.1,101.6 34.29,105.41
N$40
  Bottom 0.406: 35.56,95.25 Q4.1 | 35.56,95.25 Q5.1 | R4.1 35.56,95.25
N$41
  Bottom 0.406: Q7.2 60.96,106.68 58.42,109.22 58.42,115.57 R7.2 50.8,118.11 48.26,119.38 44.45,119.38 44.45,104.14 Q5.3
N$42
  Bottom 0.406: R9.1 R26.2 30.48,120.65 R25.1
N$44
  Bottom 0.406: D8.A R2.1 D9.A
N$45
  Bottom 0.406: D10.A 50.8,99.06 D9.C
N$46
  Bottom 0.406: R3.2 C25.1 Q4.2 38.1,92.71 41.91,96.52 50.8,96.52 D10.C
VCC  (via drill 0.81)
  Top 0.813: v74.93,15.24 v72.39,24.13 | v74.93,38.1 v74.93,72.39 v74.93,100.33 74.93,104.14 69.85,107.95 69.85,121.92 v68.58,123.19 | v22.86,100.33 22.86,113.03 22.86,114.3 30.48,121.92 40.64,121.92 v41.91,123.19
  Bottom 0.813: R10.2 78.74,93.98 74.93,97.79 v74.93,100.33 Q1.3 R2.2 | E1.14 C1.1 v68.58,123.19 62.23,121.92 | 62.23,121.92 R5.2 R11.2 v41.91,123.19 38.1,119.38 38.1,118.11 40.64,115.57 Q2.3 | 62.23,121.92 Q6.1 | v22.86,100.33 R4.2 | C3.1 v74.93,15.24 E3.14 | v74.93,38.1 C2.1 74.93,31.75 74.93,26.67 v72.39,24.13 | v74.93,38.1 E2.14 v74.93,38.1 | U$1.BA2 116.84,58.42 104.14,58.42 C4.1 C5.+ 91.44,68.58 | 91.44,68.58 R24.2 | 91.44,68.58 87.63,72.39 v74.93,72.39
  pour Bottom: 71.12,16.51 74.93,16.51 78.74,12.7 77.47,12.7
  pour Bottom: 74.93,73.66 74.93,71.12 83.82,71.12 87.63,69.85 90.17,67.31 90.17,62.23 91.44,62.23 91.44,67.31 95.25,67.31 105.41,57.15 110.49,57.15 113.03,58.42 105.41,58.42 101.6,62.23 101.6,68.58 87.63,73.66
  pour Bottom: 78.74,31.75 76.2,38.1 74.93,39.37 71.12,35.56 71.12,34.29 74.93,30.48 74.93,26.67 71.12,24.13 71.12,22.86 73.66,22.86 77.47,26.67

### Text on the board
Bottom: 7-72P | PHASE LOCK CLOCK M420C